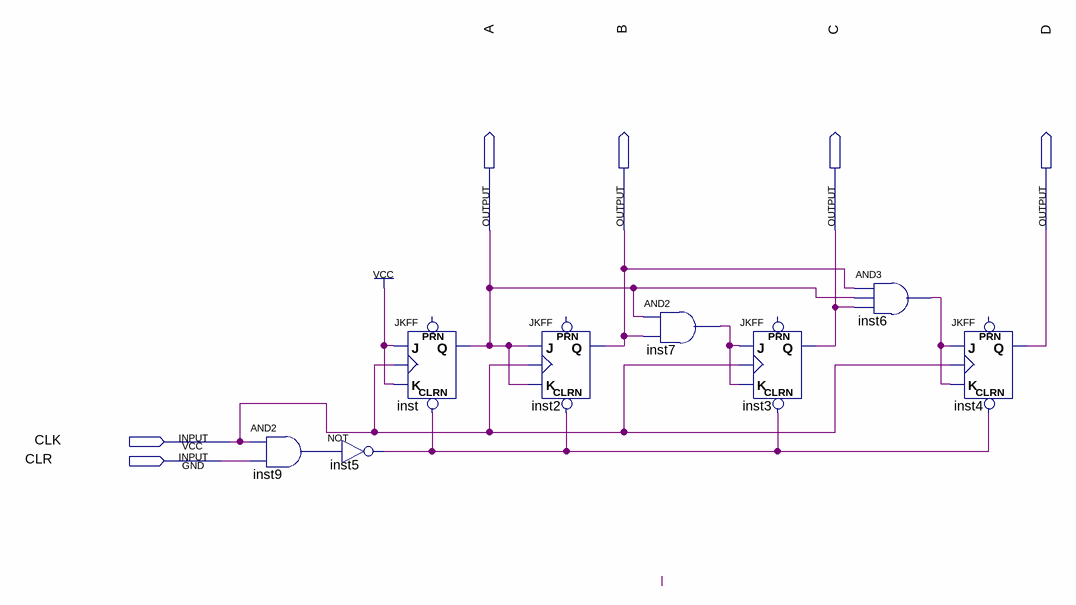
[diagram p0: schematic sheet]
// Quartus schematic counter.bdf as structural Verilog: 8 symbols, 6 pins
module counter (
  input  CLK,
  input  CLR,
  output A,
  output B,
  output C,
  output D
);

  wire inst5_out, inst6_out, inst7_out, inst9_out;

  and inst9 (inst9_out, CLK, CLR);
  not inst5 (inst5_out, inst9_out);
  JKFF inst (.CLRN(inst5_out), .K(1'b1), .J(1'b1), .CLK(CLK), .Q(A));  // open: PRN
  JKFF inst2 (.CLRN(inst5_out), .K(A), .J(A), .CLK(CLK), .Q(B));  // open: PRN
  and inst7 (inst7_out, A, B);
  JKFF inst3 (.CLRN(inst5_out), .K(inst7_out), .J(inst7_out), .CLK(CLK), .Q(C));  // open: PRN
  and inst6 (inst6_out, B, A, C);
  JKFF inst4 (.CLRN(inst5_out), .K(inst6_out), .J(inst6_out), .CLK(CLK), .Q(D));  // open: PRN
endmodule
